# Altium schematic sheet WiDSO.SchDoc
size A4
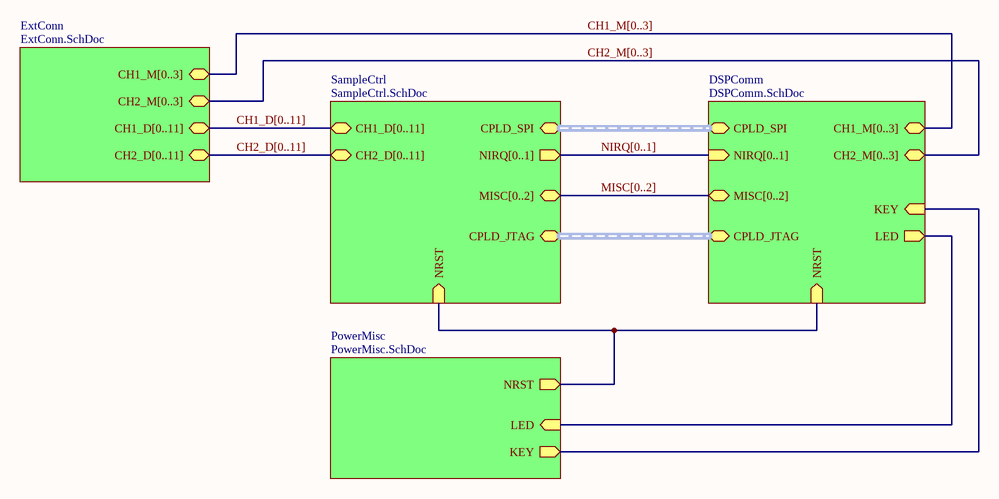
[diagram p0: WiDSO.SchDoc]

## Sub-sheets
DSPComm = DSPComm.SchDoc: CPLD_SPI (harness SPI), NIRQ[0..1] (in), MISC[0..2] (bidir), CPLD_JTAG (harness JTAG), CH1_M[0..3] (bidir), CH2_M[0..3] (bidir), LED (out), KEY (in), NRST (in)
ExtConn = ExtConn.SchDoc: CH1_D[0..11] (bidir), CH2_D[0..11] (bidir), CH1_M[0..3] (bidir), CH2_M[0..3] (bidir)
PowerMisc = PowerMisc.SchDoc: LED (in), KEY (out), NRST (out)
SampleCtrl = SampleCtrl.SchDoc: CH1_D[0..11] (bidir), CH2_D[0..11] (bidir), CPLD_SPI (harness SPI), NIRQ[0..1] (out), MISC[0..2] (bidir), CPLD_JTAG (harness JTAG), NRST (in)

## Nets
(unnamed): sheet SampleCtrl/NRST, sheet DSPComm/NRST, sheet PowerMisc/NRST
(unnamed): sheet DSPComm/LED, sheet PowerMisc/LED
(unnamed): sheet DSPComm/KEY, sheet PowerMisc/KEY

## Buses and harness runs
bus CH1_D[0..11] = sheet ExtConn/CH1_D[0..11] = sheet SampleCtrl/CH1_D[0..11]
bus CH1_M[0..3] = sheet DSPComm/CH1_M[0..3] = sheet ExtConn/CH1_M[0..3]
bus CH2_D[0..11] = sheet ExtConn/CH2_D[0..11] = sheet SampleCtrl/CH2_D[0..11]
bus CH2_M[0..3] = sheet DSPComm/CH2_M[0..3] = sheet ExtConn/CH2_M[0..3]
bus MISC[0..2] = sheet DSPComm/MISC[0..2] = sheet SampleCtrl/MISC[0..2]
bus NIRQ[0..1] = sheet DSPComm/NIRQ[0..1] = sheet SampleCtrl/NIRQ[0..1]
harness sheet DSPComm/CPLD_JTAG = sheet SampleCtrl/CPLD_JTAG
harness sheet DSPComm/CPLD_SPI = sheet SampleCtrl/CPLD_SPI